# EAGLE schematic molecule-io (EAGLE 9.2.2)
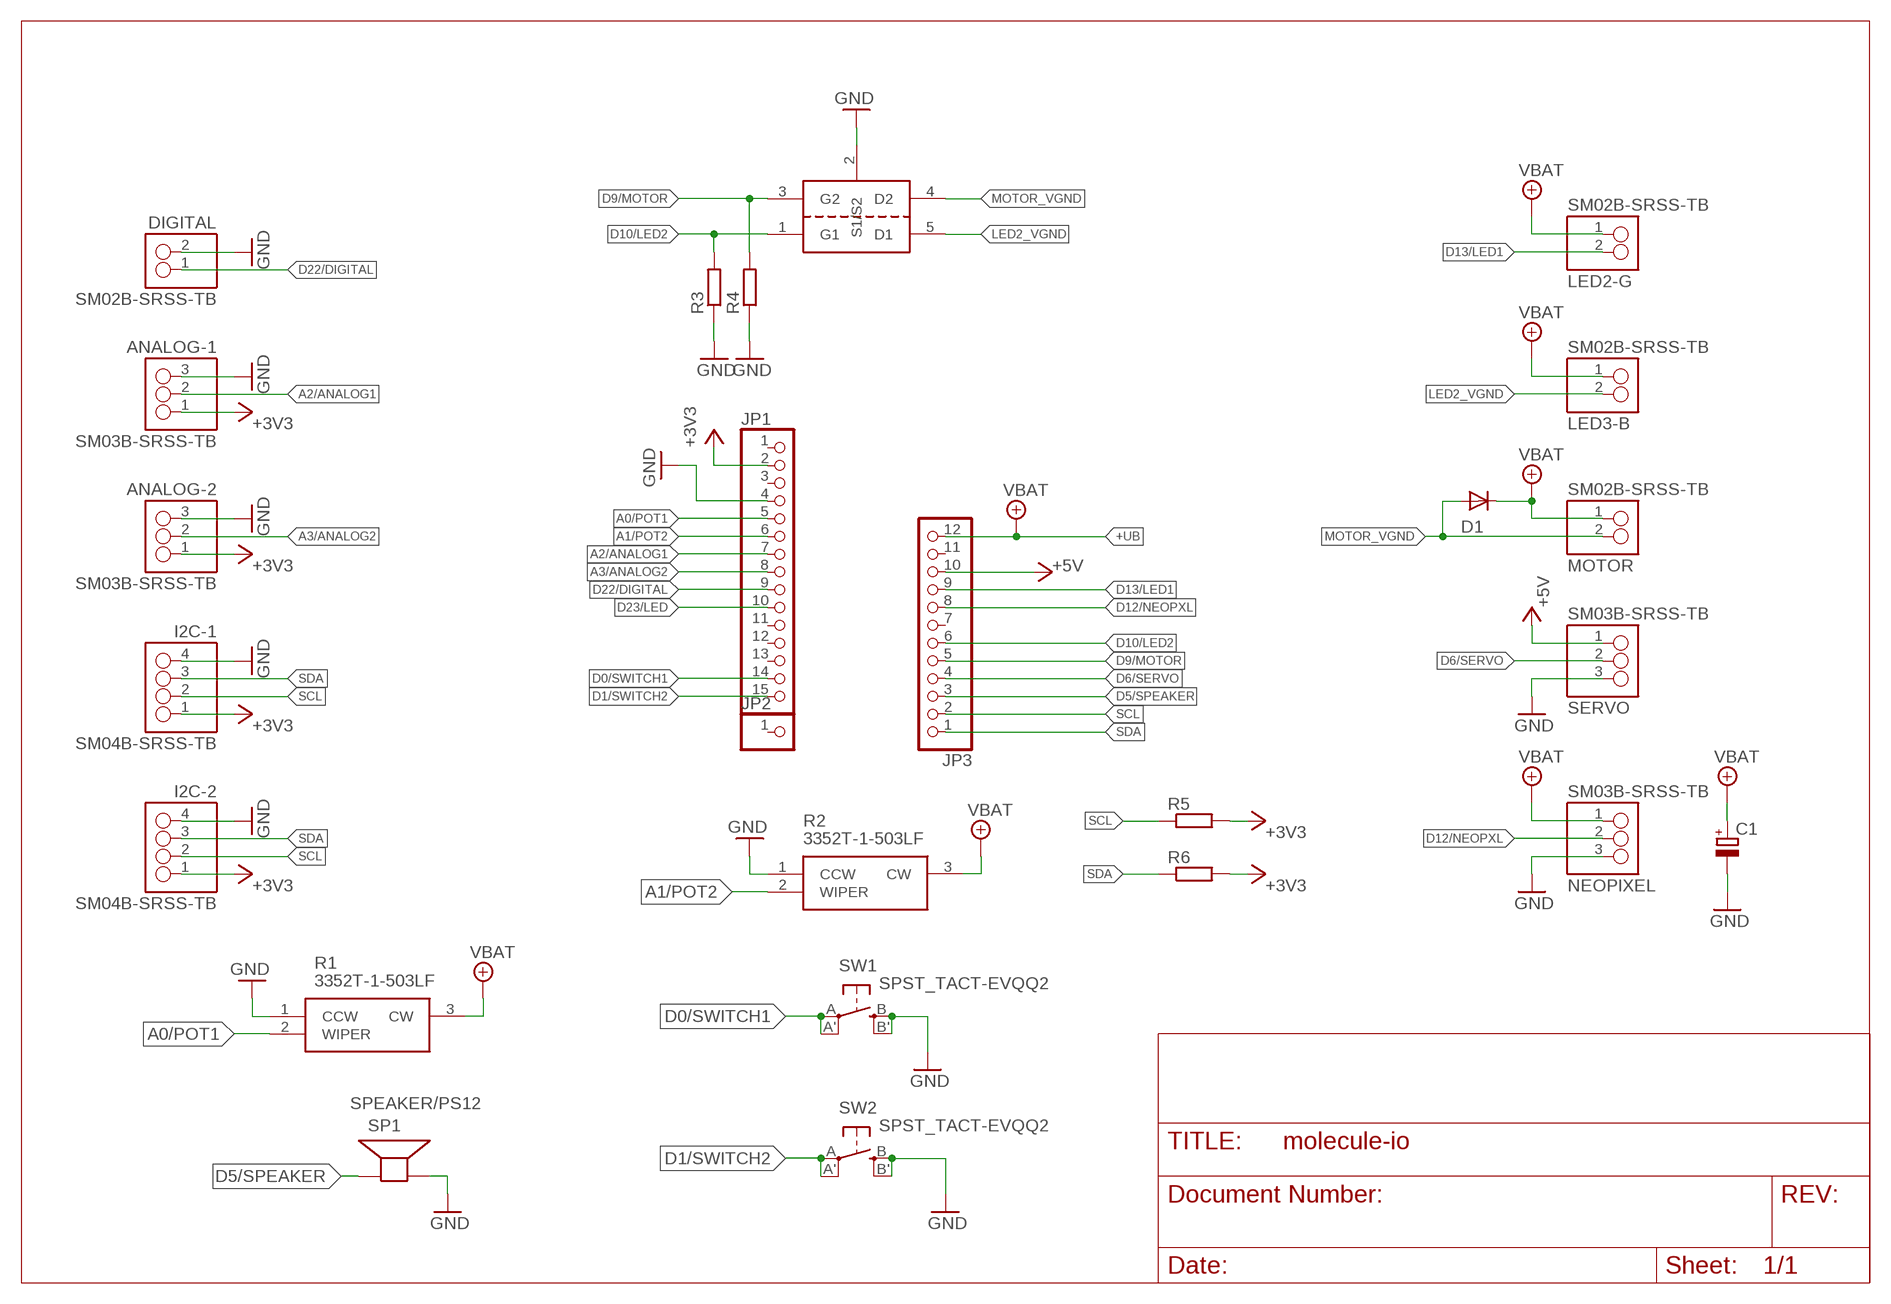
[diagram p0: schematic, sheet 1]

## Parts
ANALOG-1  SM03B-SRSS-TB  [SM03B-SRSS-TB]
ANALOG-2  SM03B-SRSS-TB  [SM03B-SRSS-TB]
C1  CPOL-EUD  [PANASONIC_D]
D1  DIODE-DO-214AC  [DO-214AC]
DIGITAL  SM02B-SRSS-TB  [SM02B-SRSS-TB]
I2C-1  SM04B-SRSS-TB  [SM04B-SRSS-TB]
I2C-2  SM04B-SRSS-TB  [SM04B-SRSS-TB]
JP1  PINHD-1X15-CB  [1X15-CB]
JP2  PINHD-1X1CB  [1X01-CLEANBIG]
JP3  PINHD-1X12-CB  [1X12-CB]
LED2-G  SM02B-SRSS-TB  [SM02B-SRSS-TB]
LED3-B  SM02B-SRSS-TB  [SM02B-SRSS-TB]
MOTOR  SM02B-SRSS-TB  [SM02B-SRSS-TB]
NEOPIXEL  SM03B-SRSS-TB  [SM03B-SRSS-TB]
R1  3352T-1-503LF  [3352T]
R2  3352T-1-503LF  [3352T]
R3  R-EU_R0603  [R0603]
R4  R-EU_R0603  [R0603]
R5  R-EU_R0603  [R0603]
R6  R-EU_R0603  [R0603]
SERVO  SM03B-SRSS-TB  [SM03B-SRSS-TB]
SP1  SPEAKER/PS12  [PS12]
SW1  SPST_TACT-EVQQ2  [EVQ-Q2]
SW2  SPST_TACT-EVQQ2  [EVQ-Q2]
U1  QS5K2  [SOT23-5L]

## Nets
+3V3: ANALOG-1.1 ANALOG-2.1 I2C-1.1 I2C-2.1 JP1.2 R5.2 R6.2
+5V: JP3.10 SERVO.1
+UB: C1.+ D1.C JP3.12 LED2-G.1 LED3-B.1 MOTOR.1 NEOPIXEL.1 R1.3(CW) R2.3(CW) ; supply symbol labelled VBAT
A0/POT1: JP1.5 R1.2(WIPER)
A1/POT2: JP1.6 R2.2(WIPER)
A2/ANALOG1: ANALOG-1.2 JP1.7
A3/ANALOG2: ANALOG-2.2 JP1.8
D0/SWITCH1: JP1.14 SW1.A'(P1) SW1.A(P)
D1/SWITCH2: JP1.15 SW2.A'(P1) SW2.A(P)
D5/SPEAKER: JP3.3 SP1.P$1(+)
D6/SERVO: JP3.4 SERVO.2
D9/MOTOR: JP3.5 R4.2 U1.3(G2)
D10/LED2: JP3.6 R3.2 U1.1(G1)
D12/NEOPXL: JP3.8 NEOPIXEL.2
D13/LED1: JP3.9 LED2-G.2
D22/DIGITAL: DIGITAL.1 JP1.9
D23/LED: JP1.10
GND: ANALOG-1.3 ANALOG-2.3 C1.- DIGITAL.2 I2C-1.4 I2C-2.4 JP1.4 NEOPIXEL.3 R1.1(CCW) R2.1(CCW) R3.1 R4.1 SERVO.3 SP1.P$2(-) SW1.B'(S1) SW1.B(S) SW2.B'(S1) SW2.B(S) U1.2(S1/S2)
LED2_VGND: LED3-B.2 U1.5(D1)
MOTOR_VGND: D1.A MOTOR.2 U1.4(D2)
SCL: I2C-1.2 I2C-2.2 JP3.2 R5.1
SDA: I2C-1.3 I2C-2.3 JP3.1 R6.1
Unconnected: JP1.1 JP1.3 JP1.11 JP1.12 JP1.13 JP2.1 JP3.7 JP3.11

## Library data of the parts
ANALOG-1 ANALOG-2 NEOPIXEL SERVO = con-jst-sh:SM03B-SRSS-TB
C1 = rcl:CPOL-EU: POLARIZED CAPACITOR, European symbol
D1 = diode:DIODE-: DIODE
DIGITAL LED2-G LED3-B MOTOR = con-jst-sh:SM02B-SRSS-TB
I2C-1 I2C-2 = con-jst-sh:SM04B-SRSS-TB
JP1 = adafruit:PINHD-1X15: PIN HEADER
JP2 = adafruit:PINHD-1X1: Pin header 1x1 for 0.1" spacing With round pins
JP3 = adafruit:PINHD-1X12: PIN HEADER
R1 R2 = 3352T-1-503LF:3352T-1-503LF: POT 50K OHM THUMBWHEEL CERM ST Source: Datasheet <http://www.bourns.com/docs/Product-Datasheets/3352.pdf>; ALLIED_NUMBER: 70154023; ALLIED_PRICE-STOCK: https://www.alliedelec.com/bourns-3352t-1-503lf/70154023/; ARROW_PART_NUMBER: 3352T-1-503LF; ARROW_PRICE-STOCK: https://www.arrow.com/en/products/3352t-1-503lf/bourns; DESCRIPTION: POT 50K OHM THUMBWHEEL CERM ST; HEIGHT: mm; MANUFACTURER_NAME: Bourns; MANUFACTURER_PART_NUMBER: 3352T-1-503LF
R3-R6 = rcl:R-EU_: RESISTOR, European symbol
SP1 = adafruit:SPEAKER: SPEAKER Source: Buerklin Added PS12 (for part # PS1240 piezo) http://www.ladyada.net/library/pcb/eaglelibrary.html
SW1 SW2 = adafruit:SPST_TACT: SMT 6mm switch, EVQQ2 series http://www.ladyada.net/library/eagle
U1 = qs5k2:QS5K2